# EAGLE schematic inputProtection (EAGLE 9.6.2)
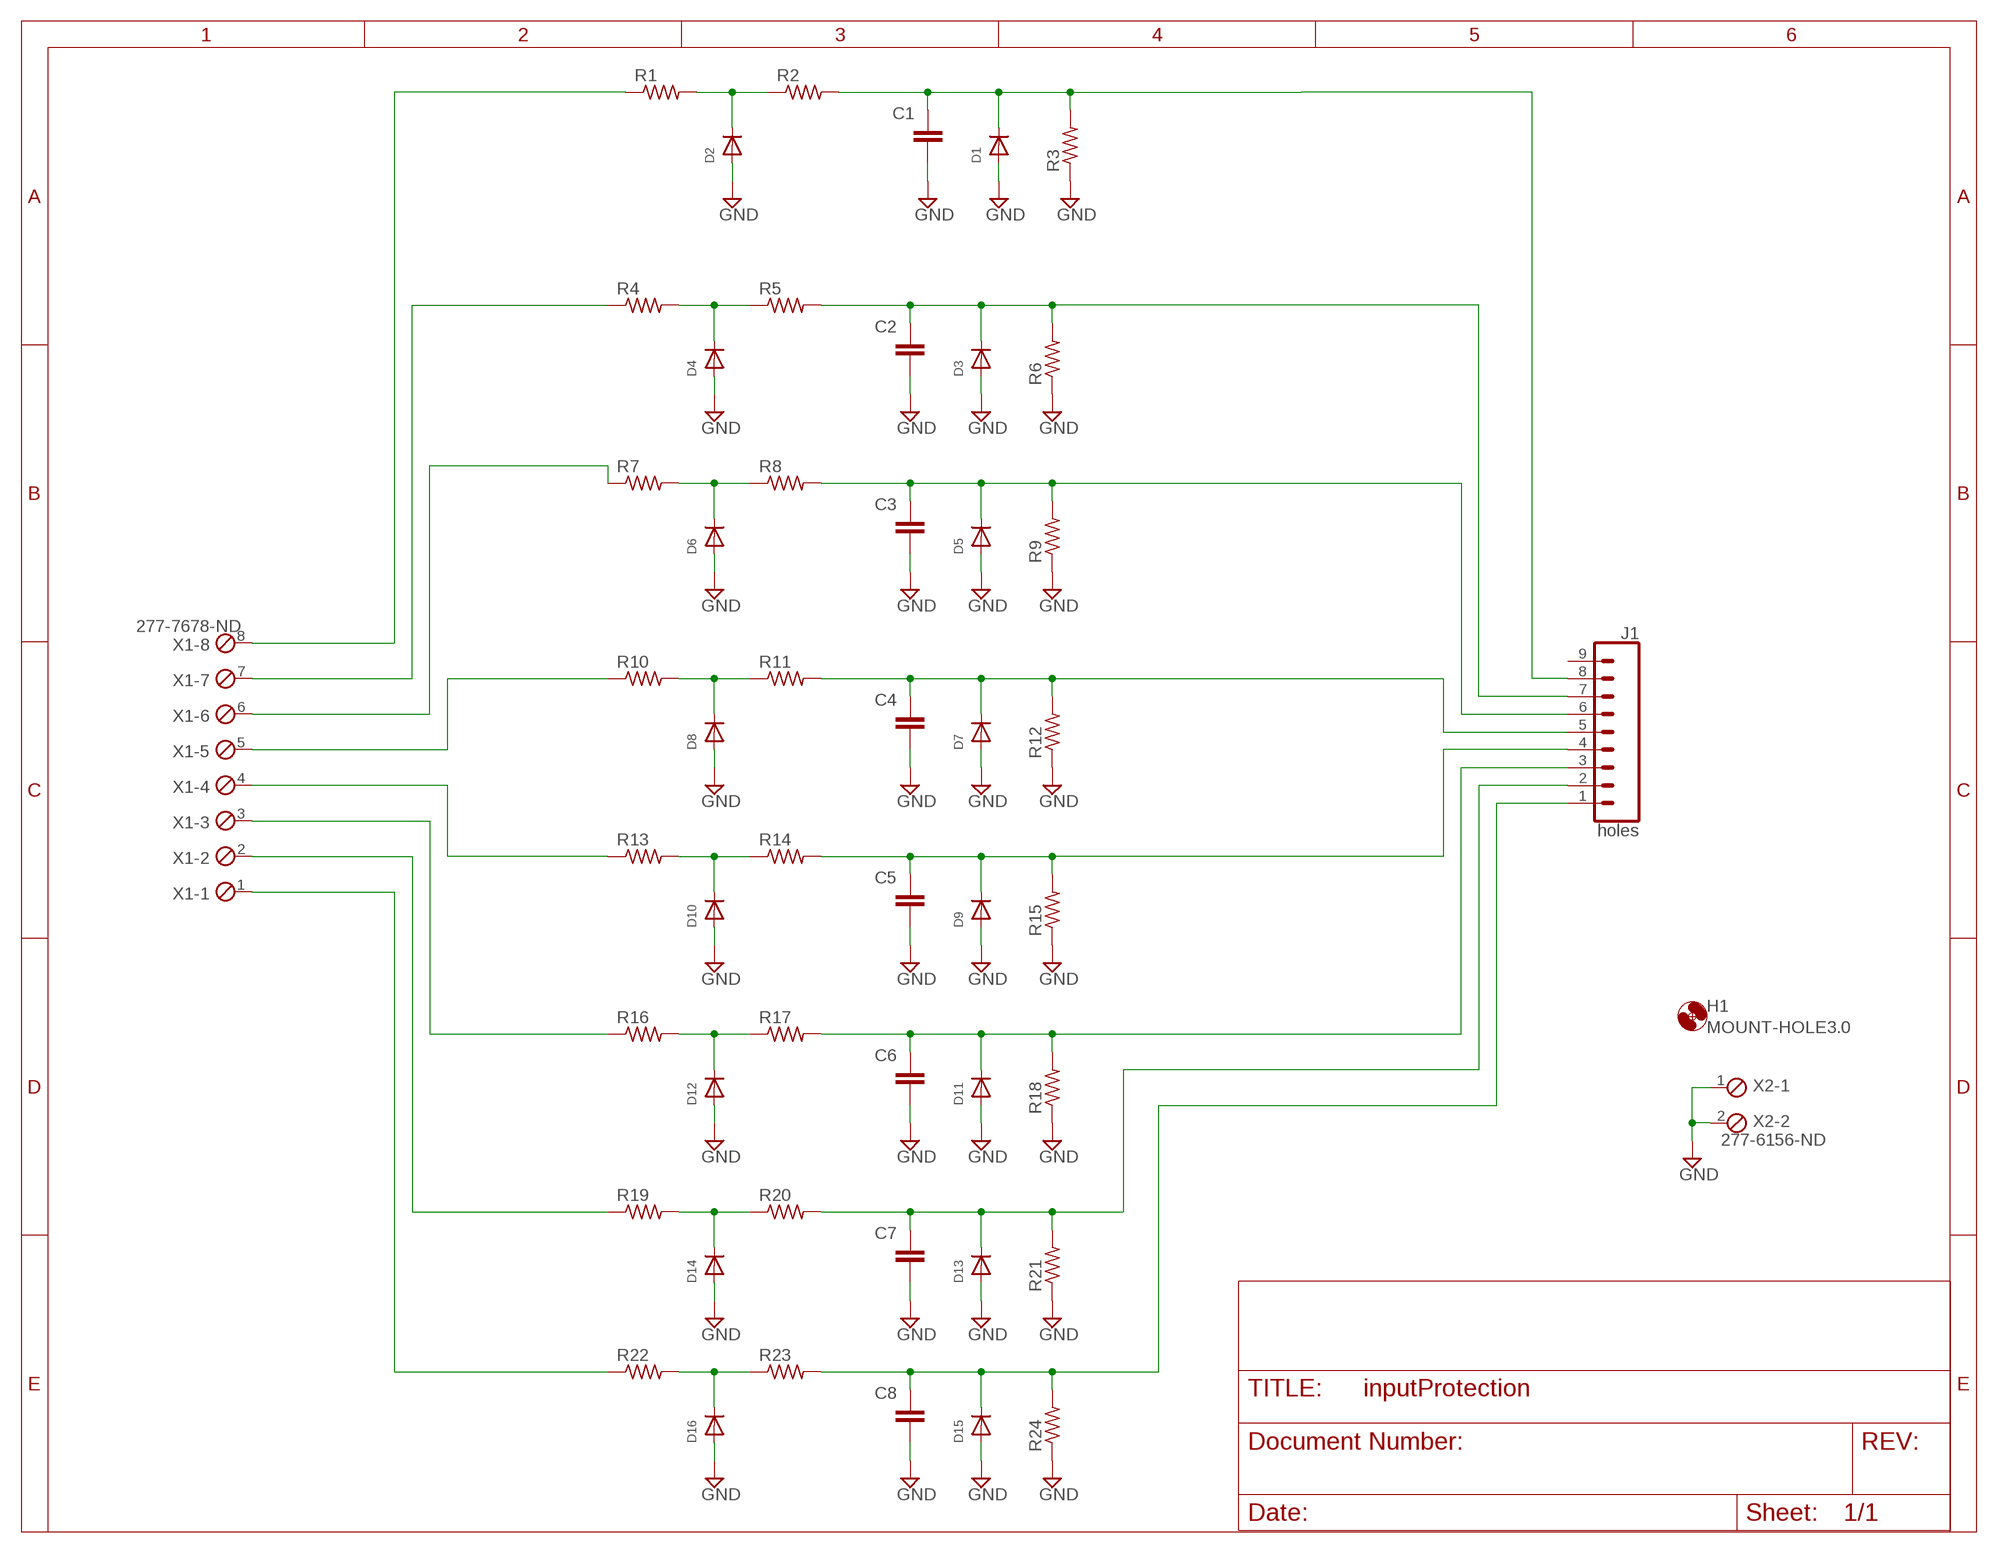
[diagram p0: schematic, sheet 1]

## Parts
C1  CC0805KRX7R9BB104  [CAP_0805]
C2  CC0805KRX7R9BB104  [CAP_0805]
C3  CC0805KRX7R9BB104  [CAP_0805]
C4  CC0805KRX7R9BB104  [CAP_0805]
C5  CC0805KRX7R9BB104  [CAP_0805]
C6  CC0805KRX7R9BB104  [CAP_0805]
C7  CC0805KRX7R9BB104  [CAP_0805]
C8  CC0805KRX7R9BB104  [CAP_0805]
D1  BZT52C4V7-13FDICT-ND  DIODESOD-123  [SOD-123]
D2  BAS70WS_R1_00001  DIODESOD-323F  [SOD-323F]
D3  BZT52C4V7-13FDICT-ND  DIODESOD-123  [SOD-123]
D4  BAS70WS_R1_00001  DIODESOD-323F  [SOD-323F]
D5  BZT52C4V7-13FDICT-ND  DIODESOD-123  [SOD-123]
D6  BAS70WS_R1_00001  DIODESOD-323F  [SOD-323F]
D7  BZT52C4V7-13FDICT-ND  DIODESOD-123  [SOD-123]
D8  BAS70WS_R1_00001  DIODESOD-323F  [SOD-323F]
D9  BZT52C4V7-13FDICT-ND  DIODESOD-123  [SOD-123]
D10  BAS70WS_R1_00001  DIODESOD-323F  [SOD-323F]
D11  BZT52C4V7-13FDICT-ND  DIODESOD-123  [SOD-123]
D12  BAS70WS_R1_00001  DIODESOD-323F  [SOD-323F]
D13  BZT52C4V7-13FDICT-ND  DIODESOD-123  [SOD-123]
D14  BAS70WS_R1_00001  DIODESOD-323F  [SOD-323F]
D15  BZT52C4V7-13FDICT-ND  DIODESOD-123  [SOD-123]
D16  BAS70WS_R1_00001  DIODESOD-323F  [SOD-323F]
H1  MOUNT-HOLE3.0  [3,0]
J1  holes  CONN_09LONGPADS  [1X09_LONGPADS]
R1  10 RHM10KCT-ND  R-US_R0805  [R0805]
R2  1k RHM1.0KKCT-ND  R-US_R0805  [R0805]
R3  10k RHM10KKCT-ND  R-US_R0805  [R0805]
R4  10 RHM10KCT-ND  R-US_R0805  [R0805]
R5  1k RHM1.0KKCT-ND  R-US_R0805  [R0805]
R6  10k RHM10KKCT-ND  R-US_R0805  [R0805]
R7  10 RHM10KCT-ND  R-US_R0805  [R0805]
R8  1k RHM1.0KKCT-ND  R-US_R0805  [R0805]
R9  10k RHM10KKCT-ND  R-US_R0805  [R0805]
R10  10 RHM10KCT-ND  R-US_R0805  [R0805]
R11  1k RHM1.0KKCT-ND  R-US_R0805  [R0805]
R12  10k RHM10KKCT-ND  R-US_R0805  [R0805]
R13  10 RHM10KCT-ND  R-US_R0805  [R0805]
R14  1k RHM1.0KKCT-ND  R-US_R0805  [R0805]
R15  10k RHM10KKCT-ND  R-US_R0805  [R0805]
R16  10 RHM10KCT-ND  R-US_R0805  [R0805]
R17  1k RHM1.0KKCT-ND  R-US_R0805  [R0805]
R18  10k RHM10KKCT-ND  R-US_R0805  [R0805]
R19  10 RHM10KCT-ND  R-US_R0805  [R0805]
R20  1k RHM1.0KKCT-ND  R-US_R0805  [R0805]
R21  10k RHM10KKCT-ND  R-US_R0805  [R0805]
R22  10 RHM10KCT-ND  R-US_R0805  [R0805]
R23  1k RHM1.0KKCT-ND  R-US_R0805  [R0805]
R24  10k RHM10KKCT-ND  R-US_R0805  [R0805]
X1  277-7678-ND  MPT8  [8POL254]
X2  277-6156-ND  MPT2  [2POL254]

## Nets
GND: C1.2 C2.2 C3.2 C4.2 C5.2 C6.2 C7.2 C8.2 D1.A D2.A D3.A D4.A D5.A D6.A D7.A D8.A D9.A D10.A D11.A D12.A D13.A D14.A D15.A D16.A R3.1 R6.1 R9.1 R12.1 R15.1 R18.1 R21.1 R24.1 X2.1 X2.2
N$1: D2.C R1.2 R2.1
N$2: C1.1 D1.C J1.8 R2.2 R3.2
N$3: D4.C R4.2 R5.1
N$4: C2.1 D3.C J1.7 R5.2 R6.2
N$5: D6.C R7.2 R8.1
N$6: C3.1 D5.C J1.6 R8.2 R9.2
N$7: D8.C R10.2 R11.1
N$8: C4.1 D7.C J1.5 R11.2 R12.2
N$9: D10.C R13.2 R14.1
N$10: C5.1 D9.C J1.4 R14.2 R15.2
N$11: D12.C R16.2 R17.1
N$12: C6.1 D11.C J1.3 R17.2 R18.2
N$13: D14.C R19.2 R20.1
N$14: C7.1 D13.C J1.2 R20.2 R21.2
N$15: D16.C R22.2 R23.1
N$16: C8.1 D15.C J1.1 R23.2 R24.2
N$17: R1.1 X1.8
N$18: R4.1 X1.7
N$19: R7.1 X1.6
N$20: R10.1 X1.5
N$21: R13.1 X1.4
N$22: R16.1 X1.3
N$23: R19.1 X1.2
N$24: R22.1 X1.1
Unconnected: J1.9

## Library data of the parts
C1-C8 = Resistor_Capacitor:CC0805KRX7R9BB104: CAP CER 0.1UF 50V X7R 0805 Manufacturer's datasheet <http://www.yageo.com/documents/recent/UPY-GPHC_X7R_6.3V-to-50V_18.pdf>; CREATED_BY: PCBLayout.com; DIGIKEY_PART_NUMBER: ECH-U1C103JX5; MANUFACTURER: Yageo; MPN: ECH-U1C103JX5; PACKAGE: SMD 0805
D1-D16 = adafruit:DIODE: Diode SMADIODE - SMA Surface Mount Package 20V 1A Schottky Diode Digikey: 641-1014-6-ND DO-1N4148 - Through Hole Small Current Diode SOD-123 20V 1 A (.5mV Vf) Schottky Diode - Digikey: MBRX120TPMSCT-ND SOD-323 10V 570mA (.38mV Vf, 3ns) Schottky Diode - Digikey: ZLLS410CT-ND SOD-523 30V 30mA Schottky Diode (RB751S-40TE61) - Digikey: RB751S-40TE61CT-ND SOT23-R/W - SOT23 Package (R = Solder Paste/Reflow Ovens, W = Hand-Soldering) BAT54Film 40V 300mA - Digikey: 497-7162-1-ND
H1 = holes:MOUNT-HOLE: MOUNTING HOLE with drill center marker
J1 = SparkFun-Connectors:CONN_09: Multi connection point. Often used as Generic Header-pin footprint for 0.1 inch spaced/style header connections On any of the 0.1 inch spaced packages, you can populate with these: Break Away Headers - Straight <https://www.sparkfun.com/products/116> (PRT-00116) Break Away Male Headers - Right Angle <https://www.sparkfun.com/products/553> (PRT-00553) Female Headers <https://www.sparkfun.com/products/115> (PRT-00115) Break Away Headers - Machine Pin <https://www.sparkfun.com/products/117> (PRT-00117) Break Away Female Headers - Swiss Machine Pin <https://www.sparkfun.com/products/743> (PRT-00743) For SCREWTERMINALS and SPRING TERMINALS visit here: Screw Terimnals on SparkFun.com <https://www.sparkfun.com/search/results?term=Screw+Terminals> (5mm/3.5mm/2.54mm spacing) This device is also useful as a general connection point to wire up your design to another part of your project. Our various solder wires solder well into these plated through hole pads. Hook-Up Wire - Assortment (Stranded, 22 AWG) <https://www.sparkfun.com/products/11375> (PRT-11375) Hook-Up Wire - Assortment (Solid Core, 22 AWG) <https://www.sparkfun.com/products/11367> (PRT-11367) View the entire wire category on our website here <https://www.sparkfun.com/categories/141> Special notes: Molex polarized connector foot print use with SKU : PRT-08231 with associated crimp pins and housings. 1MM SMD Version SKU: PRT-10208 NOTES ON THE VARIANTS LOCK and LOCK_LONGPADS... This footprint was designed to help hold the alignment of a through-hole component (i.e. 6-pin header) while soldering it into place. You may notice that each hole has been shifted either up or down by 0.005 of an inch from it's more standard position (which is a perfectly straight line). This slight alteration caused the pins (the squares in the middle) to touch the edges of the holes. Because they are alternating, it causes a "brace" to hold the component in place. 0.005 has proven to be the perfect amount of "off-center" position when using our standard breakaway headers. Although looks a little odd when you look at the bare footprint, once you have a header in there, the alteration is very hard to notice. Also,if you push a header all the way into place, it is covered up entirely on the bottom side.
R1-R24 = rcl:R-US_: RESISTOR, American symbol; SPICEPREFIX: R
X1 = con-phoenix-254:MPT8: PHOENIX CONNECTOR; OC_FARNELL: unknown; OC_NEWARK: unknown
X2 = con-phoenix-254:MPT2: PHOENIX CONNECTOR; OC_FARNELL: unknown; OC_NEWARK: unknown